# Altium project u-cont.PrjPcb
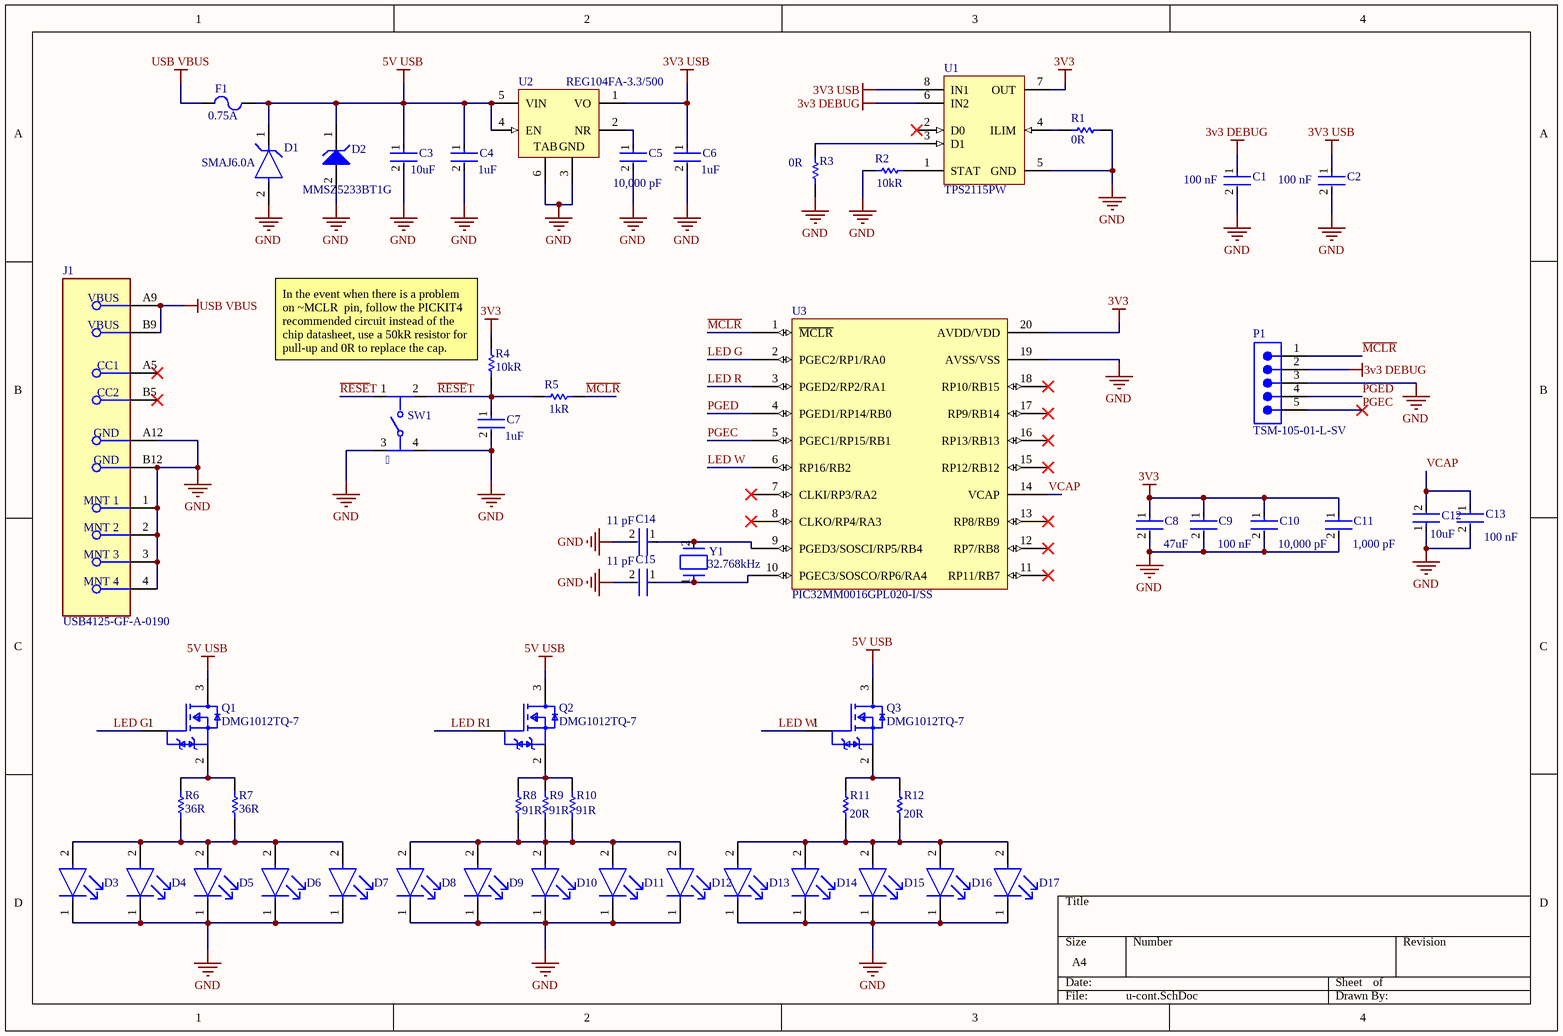
[diagram p0: u-cont.SchDoc]
1 sheet, 55 parts. Net scope: global (net labels, ports and power ports of the same name join across sheets).
Board file: u-cont.PcbDoc

## Sheet u-cont.SchDoc
size A4; SheetNumber: 1; SheetTotal: 1

### Parts
C1  Capacitance: 100 nF  [FP-CC0805-0_85-MFG]  (hidden comment: CC0805KRX7R8BB104)
C2  Capacitance: 100 nF  [FP-CC0805-0_85-MFG]  (hidden comment: CC0805KRX7R8BB104)
C3  Capacitance: 10uF  [FP-GRM21B-0_15-IPC_C]  (hidden comment: GRM21BR61E106KA73L)
C4  Capacitance: 1uF  [FP-C2012-125-0_2-IPC_A]  (hidden comment: C2012X5R1E105K125AA)
C5  Capacitance: 10,000 pF  [FP-C0805C-DN-MFG]  (hidden comment: C0805C103J5RACTU)
C6  Capacitance: 1uF  [FP-C2012-125-0_2-IPC_A]  (hidden comment: C2012X5R1E105K125AA)
C7  Capacitance: 1uF  [FP-C2012-125-0_2-IPC_A]  (hidden comment: C2012X5R1E105K125AA)
C8  Capacitance: 47uF  [FP-C0805C476M9PACTU-MFG]  (hidden comment: C0805C476M9PACTU)
C9  Capacitance: 100 nF  [FP-CC0805-0_85-MFG]  (hidden comment: CC0805KRX7R8BB104)
C10  Capacitance: 10,000 pF  [FP-C0805C-DN-MFG]  (hidden comment: C0805C103J5RACTU)
C11  Capacitance: 1,000 pF  [FP-C0805C-DN-MFG]  (hidden comment: C0805C102K5RACTU)
C12  Capacitance: 10uF  [FP-C0805C-DG-MFG]  (hidden comment: C0805C106K8PACTU)
C13  Capacitance: 100 nF  [FP-CC0805-0_85-MFG]  (hidden comment: CC0805KRX7R8BB104)
C14  value 11 pF  [FP-C0805C-DN-MFG]  (hidden comment: C0805C110J5GACTU)
C15  value 11 pF  [FP-C0805C-DN-MFG]  (hidden comment: C0805C110J5GACTU)
D1  SMAJ6.0A  [FP-SMAJ-MFG]
D2  MMSZ5233BT1G  [ONSC-SOD-123-2-425-04_V]
D3  150060GS75000  [FP-150060GS75000-MFG]  (value not drawn)
D4  150060GS75000  [FP-150060GS75000-MFG]  (value not drawn)
D5  150060GS75000  [FP-150060GS75000-MFG]  (value not drawn)
D6  150060GS75000  [FP-150060GS75000-MFG]  (value not drawn)
D7  150060GS75000  [FP-150060GS75000-MFG]  (value not drawn)
D8  150060GS75000  [FP-150060GS75000-MFG]  (value not drawn)
D9  150060GS75000  [FP-150060GS75000-MFG]  (value not drawn)
D10  150060GS75000  [FP-150060GS75000-MFG]  (value not drawn)
D11  150060GS75000  [FP-150060GS75000-MFG]  (value not drawn)
D12  150060GS75000  [FP-150060GS75000-MFG]  (value not drawn)
D13  150060GS75000  [FP-150060GS75000-MFG]  (value not drawn)
D14  150060GS75000  [FP-150060GS75000-MFG]  (value not drawn)
D15  150060GS75000  [FP-150060GS75000-MFG]  (value not drawn)
D16  150060GS75000  [FP-150060GS75000-MFG]  (value not drawn)
D17  150060GS75000  [FP-150060GS75000-MFG]  (value not drawn)
F1  Hold Current: 0.75A  [LFUS-1812L07524DR_V]  (hidden comment: 1812L075/24DR)
J1  USB4125-GF-A-0190  [FP-USB4125-GF-A-0190-MFG]
P1  TSM-105-01-L-SV  [SMTC-TSM-105-01-X-SV]
Q1  DMG1012TQ-7  [FP-SOT523-MFG]
Q2  DMG1012TQ-7  [FP-SOT523-MFG]
Q3  DMG1012TQ-7  [FP-SOT523-MFG]
R1  Resistance: 0R  [RESC2013X60X35ML10T20]  (hidden comment: RC0805JR-070RL)
R2  Resistance: 10kR  [RESC2013X60X35NL10T20]  (hidden comment: RC0805FR-0710KL)
R3  Resistance: 0R  [RESC2013X60X35ML10T20]  (hidden comment: RC0805JR-070RL)
R4  value 10kR  [RESC2013X60X35NL10T20]  (hidden comment: RC0805FR-0710KL)
R5  Resistance: 1kR  [RESC2013X60X35ML10T20]  (hidden comment: RC0805FR-071KL)
R6  value 36R  [RESC0805(2012)_L]  (hidden comment: 36R 1% 0805(2012))
R7  value 36R  [RESC0805(2012)_L]  (hidden comment: 36R 1% 0805(2012))
R8  Parameter 1: 91R  [RESC2013X70X40NL20T20]  (hidden comment: ERJ-6GEYJ910V)
R9  Parameter 1: 91R  [RESC2013X70X40NL20T20]  (hidden comment: ERJ-6GEYJ910V)
R10  Parameter 1: 91R  [RESC2013X70X40NL20T20]  (hidden comment: ERJ-6GEYJ910V)
R11  Parameter 1: 20R  [RESC2013X70X40ML20T20]  (hidden comment: ERJ-6ENF20R0V)
R12  Parameter 1: 20R  [RESC2013X70X40ML20T20]  (hidden comment: ERJ-6ENF20R0V)
SW1    [FP-PTS645SM43SMTR92LFS-MFG]
U1  TPS2115PW  [PW0008A_N]
U2  REG104FA-3.3/500  [KTT0005A_N]
U3  PIC32MM0016GPL020-I/SS  [SOP65P780X200-20N]
Y1  Frequency: 32.768kHz  [FP-ABS06-MFG]  (hidden comment: ABS06-32.768KHZ-1-T)

### Nets
3V3: C8.1 C9.1 C10.1 C11.1 R4.1 U1.7(OUT) U3.20(AVDD/VDD)
3v3 DEBUG: C1.1 P1.2 U1.6(IN2)
3V3 USB: C2.1 C6.1 U1.8(IN1) U2.1(VO)
5V USB: C3.1 C4.1 D1.1(C) D2.1(K) F1.2 Q1.3(D) Q2.3(D) Q3.3(D) U2.4(EN) U2.5(VIN)
GND: C1.2 C2.2 C3.2 C4.2 C5.2 C6.2 C7.2 C8.2 C9.2 C10.2 C11.2 C12.1 C13.2 C14.2 C15.2 D1.2(A) D2.2(A) D3.1(C) D4.1(C) D5.1(C) D6.1(C) D7.1(C) D8.1(C) D9.1(C) D10.1(C) D11.1(C) D12.1(C) D13.1(C) D14.1(C) D15.1(C) D16.1(C) D17.1(C) J1.1(MNT_1) J1.2(MNT_2) J1.3(MNT_3) J1.4(MNT_4) J1.A12(GND) J1.B12(GND) P1.3 R1.1 R2.1 R3.1 SW1.3 SW1.4 U1.5(GND) U2.3(GND) U2.6(TAB) U3.19(AVSS/VSS)
USB VBUS: F1.1 J1.A9(VBUS) J1.B9(VBUS)
~{MCLR}: P1.1 R5.2 U3.1(~{MCLR})
~{RESE}T: C7.1 R4.2 R5.1 SW1.1 SW1.2
LED G: Q1.1(G) U3.2(PGEC2/RP1/RA0)
LED R: Q2.1(G) U3.3(PGED2/RP2/RA1)
LED W: Q3.1(G) U3.6(RP16/RB2)
PGEC: P1.5 U3.5(PGEC1/RP15/RB1)
PGED: P1.4 U3.4(PGED1/RP14/RB0)
VCAP: C12.2 C13.1 U3.14(VCAP)
NetC5_1: C5.1 U2.2(NR)
NetC14_1: C14.1 U3.9(PGED3/SOSCI/RP5/RB4) Y1.2
NetC15_1: C15.1 U3.10(PGEC3/SOSCO/RP6/RA4) Y1.1
NetD3_2: D3.2(A) D4.2(A) D5.2(A) D6.2(A) D7.2(A) R6.1 R7.1
NetD8_2: D8.2(A) D9.2(A) D10.2(A) D11.2(A) D12.2(A) R8.1 R9.1 R10.1
NetD13_2: D13.2(A) D14.2(A) D15.2(A) D16.2(A) D17.2(A) R11.1 R12.1
NetQ1_2: Q1.2(S) R6.2 R7.2
NetQ2_2: Q2.2(S) R8.2 R9.2 R10.2
NetQ3_2: Q3.2(S) R11.2 R12.2
NetR1_2: R1.2 U1.4(ILIM)
NetR2_2: R2.2 U1.1(STAT)
NetR3_2: R3.2 U1.3(D1)

Not connected (* = marked no-connect by the designer): J1 A5(CC1)* B5(CC2)*; U1 2(D0)*; U3 7(CLKI/RP3/RA2)* 8(CLKO/RP4/RA3)* 11(RP11/RB7)* 12(RP7/RB8)* 13(RP8/RB9)* 15(RP12/RB12)* 16(RP13/RB13)* 17(RP9/RB14)* 18(RP10/RB15)*

### Notes on the sheet
- (near R4) In the event when there is a problem on ~MCLR  pin, follow the PICKIT4 recommended circuit instead of the chip datasheet, use a 50kR resistor for pull-up and 0R to replace the cap.

### Library data of the parts
C1 C2 C9 C13 = CMP-1036-04410-2: CAP CER 0.1UF 25V X7R 0805; Manufacturer: Yageo; Tolerance: 0.1; Material: Ceramic; Value: 100 nF; ComponentLink2URL: http://www.yageo.com/documents/recent/UPY-GPHC_Y5V_6.3V-to-50V_8.pdf; Category: Cap; Mouser Description: Multilayer Ceramic Capacitors MLCC - SMD/SMT 100nF 25V X7R 10%; Manufacturer Part Number: CC0805KRX7R8BB104; Device Class L1: Passive Components; Footprint Url: http://www.yageo.com/exep/pages/download/literatures/UPY-C_GEN_24.pdf; Height: 0.95mm; Digikey Description: CAP CER 0.1UF 25V X7R 0805; Lead Free: Yes; Temperature Range High: +85°C; Temperature: -30°C to +85°C; Ipc Land Pattern Name: CAPC200125X85; Automotive: No; Octopart: https://octopart.com/cc0805krx7r8bb104-yageo-39467766; Device Class L2: Capacitors; Temperature Characteristic: X7R; Voltage Rating: 25 V; ComponentLink2Description: Datasheet; Temperature Range Low: -30°C; Device Class L3: Ceramic Capacitors; RoHS: TRUE; Package: CC0805-0.85
C3 = CMP-2007-03541-2: Chip Multilayer Ceramic Capacitors for General Purpose, 0805, 10uF, X5R, 15%, 10%, 25V; Length: 2mm; Depth: 1.25mm; Termination: SMD/SMT; Voltage: 25V; Height: 1.25mm; Material: Ceramic; Thickness: 0.053inch; Radiation Hardening: No; Min Operating Temperature: -55°C; Width: 0.049inch; Package Quantity: 1; Mount: Surface Mount; Dielectric: X5R; Packaging: Tape and Reel; Voltage Rating (DC): 25V; Lead Free: Lead Free; Max Operating Temperature: 85°C; Case Code (Imperial): 0805; Case/Package: 0805; Tolerance: 10%; Voltage Rating: 25V; Case Code (Metric): 2012
C4 C6 C7 = CMP-08246-005389-1: Multilayer Ceramic Capacitors 1μF ±10% 25V X5R SMD 0805; Min Operating Temperature: -55°C; Construction: Flat; Package Quantity: 2000; Height: 1.25mm; Resistor Type: Ceramic; Case/Package: 0805; Depth: 1.25mm; Case Code (Metric): 2012; Weight: 0.000194oz; REACH SVHC: No SVHC; Dielectric: X5R; Max Operating Temperature: 85°C; Number of Pins: 2; Thickness: 0.057inch; RoHS Compliant: Yes; Radiation Hardening: No; Lead Free: Lead Free; Case Code (Imperial): 0805; Length: 2mm; Voltage Rating: 25V; Mount: Surface Mount; Voltage Rating (DC): 25V; Packaging: Tape and Reel; Dielectric Material: Ceramic; Termination: SMD/SMT; Voltage: 25V; Tolerance: 10%; Series: C; Width: 0.049inch
C5 C10 = CMP-2007-00254-2: CAP CER 10000PF 50V X7R 0805; Manufacturer: KEMET; Value: 10,000 pF; Material: Ceramic; Temperature Coefficient: 30ppm/°C; Tolerance: 0.05; Device Class L1: Passive Components; Temperature: -55°C to +125°C; Lead Free: Yes; ComponentLink2URL: https://content.kemet.com/datasheets/KEM_C1003_C0G_SMD.pdf; Device Class L3: Ceramic Capacitors; Temperature Characteristic: X7R; Temperature Range High: +125°C; Mouser Description: Capacitor; Ceramic; Cap 0.01uF; Tol 5%; Vol-Rtg 50 V; SMT; Case 0805; X7R; TR; ComponentLink2Description: Datasheet; Manufacturer Part Number: C0805C103J5RACTU; Height: 0.88mm; Digikey Description: CAP CER 10000PF 50V X7R 0805; Temperature Range Low: -55°C; Device Class L2: Capacitors; Octopart: https://octopart.com/c0805c103j5ractu-kemet-133473; Voltage Rating: 50 V; Category: Cap; RoHS: TRUE; Automotive: No; Package: C0805C-DN; Ipc Land Pattern Name: CAPC200125X78
C8 = CMP-2007-01008-2: CAP CER 47UF 6.3V X5R 0805; Dielectric Material: Ceramic; Dissipation Factor: 5%; Tolerance: 20%; Case Code (Imperial): 0805; Mount: PCB; Width: 1.2mm; Package Quantity: 3000; Radiation Hardening: No; Packaging: Tape and Reel; Termination: SMD/SMT; Series: C0805C; Voltage: 6.3V; Depth: 1.25mm; Dielectric: X5R; Case Code (Metric): 2012; Length: 2mm; Case/Package: 0805; REACH SVHC: No SVHC; Voltage Rating (DC): 6.3V; RoHS Compliant: Yes; Height: 1.25mm; Construction: Flat; Number of Pins: 2; Voltage Rating: 6.3V; Max Operating Temperature: 85°C; Min Operating Temperature: -55°C
C11 = CMP-2007-01097-2: CAP CER 1000PF 50V X7R 0805; Manufacturer: KEMET; Value: 1,000 pF; Tolerance: 0.1; Temperature Coefficient: 30ppm/°C; Material: Ceramic; Temperature Range High: +125°C; Automotive: No; Device Class L3: Ceramic Capacitors; Category: Cap; Height: 0.88mm; Ipc Land Pattern Name: CAPC200125X78; Mouser Description: Cap Ceramic 0.001uF 50V X7R 10% SMD 0805 125C Plastic T/R; Device Class L1: Passive Components; Lead Free: Yes; Temperature Range Low: -55°C; ComponentLink2URL: https://content.kemet.com/datasheets/KEM_C1003_C0G_SMD.pdf; Octopart: https://octopart.com/c0805c102k5ractu-kemet-93010; Temperature: -55°C to +125°C; Package: C0805C-DN; RoHS: TRUE; Voltage Rating: 50 V; ComponentLink2Description: Datasheet; Digikey Description: CAP CER 1000PF 50V X7R 0805; Device Class L2: Capacitors; Manufacturer Part Number: C0805C102K5RACTU; Temperature Characteristic: X7R
C12 = CMP-2007-03243-2: CAP CER 10UF 10V X5R 0805; Manufacturer: Kemet; 3DS Part Number: 220-00001; Tolerance: 10%; Temperature Coefficient: 15%; Material: Ceramic; Device Class L2: Capacitors; Device Class L1: Passive Components; ComponentLink2URL: https://content.kemet.com/datasheets/KEM_C1006_X5R_SMD.pdf; Height: 1.4mm; Lead Free: Yes; Manufacturer Part Number: C0805C106K8PACTU; Digikey Description: CAP CER 10UF 10V X5R 0805; Octopart: https://octopart.com/c0805c106k8pactu-kemet-98697; Value: 10uF; Temperature Range Low: -55°C; Temperature: -55°C to +85°C; Automotive: No; Mouser Description: CAP CER 10UF 10V X5R 0805; Ipc Land Pattern Name: CAPC200125X125; Temperature Range High: +85°C; Voltage: 10V; RoHS: TRUE; Device Class L3: Ceramic Capacitors; ComponentLink2Description: Datasheet; Voltage Rating: 10V; Package: C0805C-DG; Temperature Characteristic: X5R; Category: Cap
C14 C15 = CMP-1036-00907-3: CAP CER 11PF 50V 5% NP0 0805; Manufacturer: KEMET; Material: Ceramic; Tolerance: 0.05; Temperature Coefficient: 30ppm/°C; Temperature Characteristic: C0G; ComponentLink2URL: https://content.kemet.com/datasheets/KEM_C1003_C0G_SMD.pdf; Height: 0.88mm; Lead Free: Yes; Temperature Range High: +125°C; Mouser Description: Multilayer Ceramic Capacitors MLCC - SMD/SMT 50volts 11pF C0G 5%; Automotive: No; Temperature: -55°C to +125°C; Device Class L3: Ceramic Capacitors; Voltage Rating: 50 V; RoHS: TRUE; Ipc Land Pattern Name: CAPC200125X78; Digikey Description: CAP CER 11PF 50V 5% NP0 0805; Capacitance: 11 pF; Temperature Range Low: -55°C; Device Class L2: Capacitors; ComponentLink2Description: Datasheet; Device Class L1: Passive Components; Category: Cap; Manufacturer Part Number: C0805C110J5GACTU; Package: C0805C-DN; Octopart: https://octopart.com/c0805c110j5gactu-kemet-15514269
D1 = CMP-08607-000083-1: TVS DIODE 6V 10.3V DO214AC; Manufacturer: Littelfuse; Breakdown Voltage: 6.67V; Number Of Channels: 1; Direction: Unidirectional; Max Junction Temp: +150°C; Peak Pulse Current: 38.8A; Peak Pulse Power: 400W; Device Class L1: Circuit Protection; Device Class L3: unset; ComponentLink2URL: https://www.littelfuse.com/~/media/electronics/datasheets/tvs_diodes/littelfuse_tvs_diode_smaj_datasheet.pdf.pdf; Lead Free: Yes; Digikey Description: TVS DIODE 6V 10.3V DO214AC; Height: 2.29mm; Reverse Standoff Voltage: 6V; Package: SMAJ; Manufacturer Part Number: SMAJ6.0A; Octopart: https://octopart.com/smaj6.0a-littelfuse-350212; Category: Diode; Automotive: No; Clamping Voltage: 10.3V; RoHS: TRUE; ComponentLink2Description: Datasheet; Temperature Range Low: -65°C; Temperature: -65°C to +150°C; Temperature Range High: +150°C; Device Class L2: TVS Diodes; Mouser Description: TVS Diodes - Transient Voltage Suppressors 60Vr 400W 4.1A 5% UniDirectional
D2 = CMP-1060-00590-1: Zener Voltage Regulator, 500 mW, 2-Pin SOD-123, Pb-Free, Tape and Reel; Manufacturer: On Semiconductor; VZ Typ (V): 6.0; P Max (W): 0.5; PackageReference: SOD-123-2-425-04; ComponentLink3URL: http://www.onsemi.com/pub_link/Collateral/425-04.PDF; DatasheetVersion: Rev. 12; PackageDescription: 2-Pin SOD, Body 1.6 x 2.69 mm; ComponentLink2URL: http://www.onsemi.com/pub_link/Collateral/MMSZ5221BT1-D.PDF; ComponentLink1URL: http://www.onsemi.com/; Mounting Technology: Surface Mount; PartNumber: MMSZ5233BT1G; ComponentLink3Description: Package Specification; ComponentLink2Description: Datasheet; ComponentLink1Description: Manufacturer URL; RoHS: Pb-Free; Packing: Tape and Reel; PackageVersion: Rev. G, 10/2009
D3-D17 = CMP-007-00036-1: Led, Green, 520 Nm, 3.2 V, 30 Ma, 430 Mcd Rohs Compliant: Yes
F1 = CMP-2000-05510-1: Poly-Fuse(R) Resettable PTC, 24 V, 100 A, -40 to 85 degC, 2-Pin SMD, RoHS, Tape and Reel; Manufacturer: Littelfuse; Resistance: 290mOhms; Current Rating - Max: 100A; Maximum Voltage: 24VDC; Trip Current: 1.5A; Maximum Voltage DC: 24V; Type: PolyFuseResettablePTC; Datasheet Version: 02/2016; Package / Case: 1812(4532metric); Mounting Technology: SurfaceMount; Packaging: Reel; Package Description: 2-Pin Surface Mount Device, Body 4.55 x 3.24 mm; Brand: Littelfuse; Manufacturer URL: http://www.littelfuse.com/; Mounting Style: SMD/SMT; Dimensions: 4.37mmLx3.07mmWx0.75mmH; Operating Temperature Range: -40Cto+85C; Product Category: ResettableFuses-PPTC; Current Rating: 100A; Termination Style: SMD/SMT; Factory Pack Quantity: 1500; Current Rating (Max): 100A; Package Reference: 1812L07524DR; RoHS: Details; Series: 1812L; Datasheet URL: http://www.littelfuse.com/~/media/electronics/datasheets/resettable_ptcs/littelfuse_ptc_1812l_datasheet.pdf.pdf
J1 = CMP-245163-000004-1: CONN RCPT TYPE C 6P SMD RA
P1 = CMP-1024-00241-1: 0.025" SQ Post Header, Surface Mount, Vertical, -55 to 125 degC, 2.54 mm Pitch, 5-Pin, Male, RoHS; Manufacturer: Samtec; Pitch: 2.54 mm; Temperature Range: -55 to 125 degC; ComponentLink3Description: Package Specification; ComponentLink1Description: Manufacturer URL; RoHS: True; PackageDescription: Single Row .100 SMT Assembly; PackageReference: TSM-105-01-X-SV; PartNumber: TSM-105-01-L-SV; ComponentLink1URL: http://www.samtec.com; ComponentLink2URL: http://www.samtec.com/documents/webfiles/pdf/TSM.PDF; Orientation: Vertical; PackageVersion: BP, 8/2002; ComponentLink3URL: http://www.samtec.com/documents/webfiles/cpdf/TSM-1XX-XX-XXX-SV-XX-XXX-XX-MKT.pdf; ComponentLink2Description: Datasheet; DatasheetVersion: F-214; Mounting Technology: Surface Mount
Q1-Q3 = CMP-12801-000068-1: MOSFET NCH 20V 630MA SOT523; Manufacturer: Diodes Inc.; Automotive Grade: Grade 0; Depletion Mode: False; Threshold Vgs Max: 1V; Turn Off Delay Time: 26.7ns; Gate Charge At Vgs: 736.6pC @ 4.5V; Pulse Drain Current: 3A; Number Of N Channels: 1; Turn On Delay Time: 5.1ns; Drain To Source Resistance: 0.3Ω; Max Forward Diode Voltage: 1.2V; Input Capacitace At Vds: 60.67pF @ 16V; Typ Forward Diode Voltage: 0.7V; Standoff Height: 0mm; Threshold Vgs Min: 0.5V; Max Junction Temp: +150°C; Rthja Max: 452°C/W; Power Dissipation: 0.28W; Continuous Drain Current: 0.63A; Gate To Source Voltage: 6V; Temperature Range Low: -55°C; RoHS: TRUE; Height: 0.9mm; ComponentLink2Description: Datasheet; Drain To Source Breakdown Voltage: 20V; Octopart: https://octopart.com/dmg1012tq-7-diodes+inc.-74468997; Automotive: Yes; Lead Free: Yes; Device Class L2: Transistors; Digikey Description: MOSFET NCH 20V 630MA SOT523; Manufacturer Part Number: DMG1012TQ-7; Package: SOT523; Drain To Source Voltage: 20V; Device Class L1: Discrete Semiconductors; Device Class L3: MOSFETs; Mouser Description: Trans MOSFET N-CH 20V 0.63A Automotive 3-Pin SOT-523 T/R; ComponentLink2URL: https://www.diodes.com/assets/Datasheets/ds31783.pdf; Temperature Range High: +150°C; Category: Trans; Footprint Url: https://www.diodes.com/assets/Package-Files/SOT523.pdf; Number Of Channels: 1; Temperature: -55°C to +150°C
R1 R3 = CMP-2100-03673-1: Chip Resistor, 0 Ohm, Jumper, +/- 5%, 0.125 W, -55 to 155 degC, 0805 (2012 Metric), RoHS, Tape and Reel; Manufacturer: Yageo; Power Rating: 125mW; Voltage Rating (DC): 150V; Temperature Coefficient: 200ppm/degreesC; Height: 0.5mm; Depth: 1.25mm; Case Code (Imperial): 0805; Lead Free: LeadFree; Military Standard: Not; Package Description: 2-Pin Surface Mounted Device, Body 2 x 1.25 mm; Case Code (Metric): 2012; Composition: ThickFilm; Voltage Rating: 150V; Manufacturer URL: http://www.yageo.com/; Packaging: TapeandReel; Package Reference: 0805; REACH SVHC: Unknown; Tolerance: 5%; Case/Package: 0805; Max Operating Temperature: 155degC; Number of Pins: 2; Min Operating Temperature: -55degC; RoHSCompliant: true; Length: 2mm; Datasheet URL: http://www.yageo.com/NewPortal/yageodocoutput?fileName=/pdf/R-Chip/PYu-RC_Group_51_RoHS_L_5.pdf; Termination: SMD/SMT; Radiation Hardening: No; Width: 1.25mm; Contact Plating: Tin; Datasheet Version: Rev. 5, 10/2016
R2 R4 = CMP-1659-00013-4: Chip Resistor, 10 KOhm, +/- 1%, 0.125 W, -55 to 155 degC, 0805 (2012 Metric), RoHS, Tape and Reel; Manufacturer: Yageo; Voltage Rating: 150 V; Mount: Surface Mount; ComponentLink1Description: Manufacturer URL; ComponentLink2URL: http://www.yageo.com/documents/recent/PYu-RC_Group_51_RoHS_L_04.pdf; Pins: 2; Length: 2 mm; Min Operating Temperature: -55 degC; Height: 0.5 mm; Mounting Technology: Surface Mount; RoHSCompliant: true; REACH SVHC: No SVHC; ComponentLink1URL: http://www.yageo.com/; Max Operating Temperature: 155 degC; PackageReference: 0805; DatasheetVersion: Rev. 4, 02/2016; Package Quantity: 5000; Packaging: Tape and Reel; ComponentLink2Description: Datasheet; PackageDescription: 2-Pin Surface Mounted Device, Body 2 x 1.25 mm
R5 = CMP-2100-03671-1: Chip Resistor, 1 KOhm, +/- 1%, 125 mW, -55 to 155 degC, 0805 (2012 Metric), RoHS, Tape and Reel; Manufacturer: Yageo; Temperature Coefficient: 100ppm/degreesC; Voltage Rating (DC): 150V; Max Power Dissipation: 125mW; Number of Pins: 2; Number of Terminations: 2; Datasheet URL: http://www.yageo.com/NewPortal/yageodocoutput?fileName=/pdf/R-Chip/PYu-RC_Group_51_RoHS_L_5.pdf; Length: 0.079inch; Package Description: 2-Pin Surface Mounted Device, Body 2 x 1.25 mm; Depth: 1.25mm; Height: 0.024inch; Military Standard: Not; Case/Package: 0805; Package Reference: 0805; RoHSCompliant: true; Lead Free: LeadFree; Packaging: TapeandReel; Package Quantity: 1; Datasheet Version: Rev. 5, 10/2016; Tolerance: 1%; Min Operating Temperature: -55degC; Voltage Rating: 150V; Composition: ThickFilm; Case Code (Imperial): 0805; Power Rating: 125mW; Width: 0.049inch; Case Code (Metric): 2012; Manufacturer URL: http://www.yageo.com/; Max Operating Temperature: 155degC; REACH SVHC: Unknown; Termination: SMD/SMT
R6 R7 = CMP-1013-00346-1: 36R 0.125W 1% 0805 (2012 Metric)  SMD; Case-EIA: 0805; Case-Metric: 2012; Power: 0.125 W; Tolerance: 1 %; Technology: SMT
R8-R10 = CMP-2001-00454-1: Manufacturer: Panasonic; Part Number: ERJ-6GEYJ910V
R11 R12 = CMP-1013-00316-2: Manufacturer: Panasonic; Part Number: ERJ-6ENF20R0V
SW1 = CMP-2000-05160-2: SWITCH TACTILE SPST-NO 0.05A 12V; Contact Resistance: 100mR; Throw Configuration: SPST; Illumination Type: Non-Illuminated; Mechanical Life: 100000Cycles; Current Rating: 50mA; Switch Function: Off-Mom; Actuator Length: 0.85mm; Actuator Material: Nylon; Actuator Type: Standard; Operating Force: 160gf; Min Operating Temperature: -20°C; REACH SVHC: No SVHC; Termination: Gull Wing; Case/Package: SMD/SMT; Packaging: Tape and Reel; Mount: Surface Mount; Voltage Rating (DC): 12V; Orientation: Straight; Lead Free: Lead Free; Contact Material: Silver; Color: Black; Max Current Rating: 50mA; Contact Plating: Silver; Depth: 9mm; Package Quantity: 1; Max Voltage Rating (DC): 12V; Length: 6mm; Max Operating Temperature: 60°C
U1 = CMP-0339-00026-2: Dual In / Single Out Autoswitching Power MUX, Manual / Auto Switching, Adj. Cur Limit, Switch Status, 2.8 to 5.5 V, -40 to 85 degC, 8-pin TSSOP (PW), Green (RoHS & no Sb/Br); Manufacturer: Texas Instruments; IN2 rDS(on)(Typ)(Ohms): 0.084; IN1 Output Current(Max)(A): 1.25; IN1 rDS(on)(Typ)(mOhm): 84; IN1, IN2 Input Voltage(Min)(V): 2.8; Number of Inputs: 2; IN1, IN2 Input Voltage(Max)(V): 5.5; SubFamily: Power Multiplexer (MUX); Code_JEDEC: MO-153; Eco-Plan: Green (RoHS & no Sb/Br); PackageReference: PW0008A; DatasheetVersion: SLVS447A; Mounting Technology: Surface Mount; PartNumber: TPS2115PW; ComponentLink1Description: Datasheet; ComponentLink1URL: http://www.ti.com/general/docs/lit/getliterature.tsp?genericPartNumber=TPS2115&fileType=pdf; IN2 Output Current(Max)(A): 1.25; PackageVersion: revG, Feb-2011; PackageDescription: 8-Pin Plastic Thin Small Outline Package 3 x 4.4 mm Body ,0.65 mm Pitch
U2 = CMP-0395-00992-2: Single Output Fast Transient Response LDO, 1 A, Fixed 3.3 V Output, 2.1 to 15 V Input, 5-pin DDPAK (KTT), -55 to 125 degC, Green (RoHS & no Sb/Br); Manufacturer: Texas Instruments; Vout Adj(Min)(V): 3.3; Vdo(Typ)(mV): 230; Vin(Min)(V): 2.1; SubFamily: Single Channel LDO; Vin(Max)(V): 15; Accuracy(%): 2; Iq(Typ)(mA): 0.6; Iout(Max)(A): 1; PackageReference: KTT0005A; PackageDescription: 3-Pin Plastic Flange Mount, Body 10.16 x 10.34 mm, Pitch 1.7 mm; Mounting Technology: Surface Mount; ComponentLink2URL: http://www.ti.com/general/docs/lit/getliterature.tsp?genericPartNumber=REG104-33&fileType=pdf; ComponentLink3Description: Package Specification; Vout Adj(Max)(V): 3.3; PartNumber: REG104FA-3.3/500; ComponentLink1Description: Manufacturer URL; Fixed Output Options(V): 3.3; ComponentLink3URL: http://www.ti.com/litv/pdf/mpsf007e; ComponentLink2Description: Datasheet; DatasheetVersion: SBVS025G; ComponentLink1URL: http://www.ti.com/; Eco-Plan: Green (RoHS & no Sb/Br); Code_JEDEC: TO-263; PackageVersion: 4200577-3/F
U3 = PIC32MM0016GPL020-I/SS: MIPS32® microAptiv™ PIC® 32MM Microcontroller IC 32-Bit Single-Core 25MHz 16KB (16K x 8) FLASH 20-SSOP
Y1 = CMP-27762-012387-2: CRYSTAL 32.7680KHZ 12.5PF SMD; Series Resistance: 90kR; Frequency Tolerance: 10ppm; Number of Pins: 2; Max Operating Temperature: 85°C; Load Capacitance: 12.5pF; Series: ABS06; Depth: 1.2mm; Height: 0.6mm; Min Operating Temperature: -40°C; Mount: Surface Mount; Lead Free: Lead Free; Width: 1.2mm; ESR (Equivalent Series Resistance): 90kR; Termination: SMD/SMT; Packaging: Tape and Reel; RoHS Compliant: Yes; REACH SVHC: No SVHC; Operating Frequency: 32.768 kHz; Case/Package: CSMD; Package Quantity: 3000; Radiation Hardening: No; Tolerance: 10ppm; Length: 2mm